# Altium schematic sheet Communication.SchDoc
size A; SheetNumber: 1; SheetTotal: 10
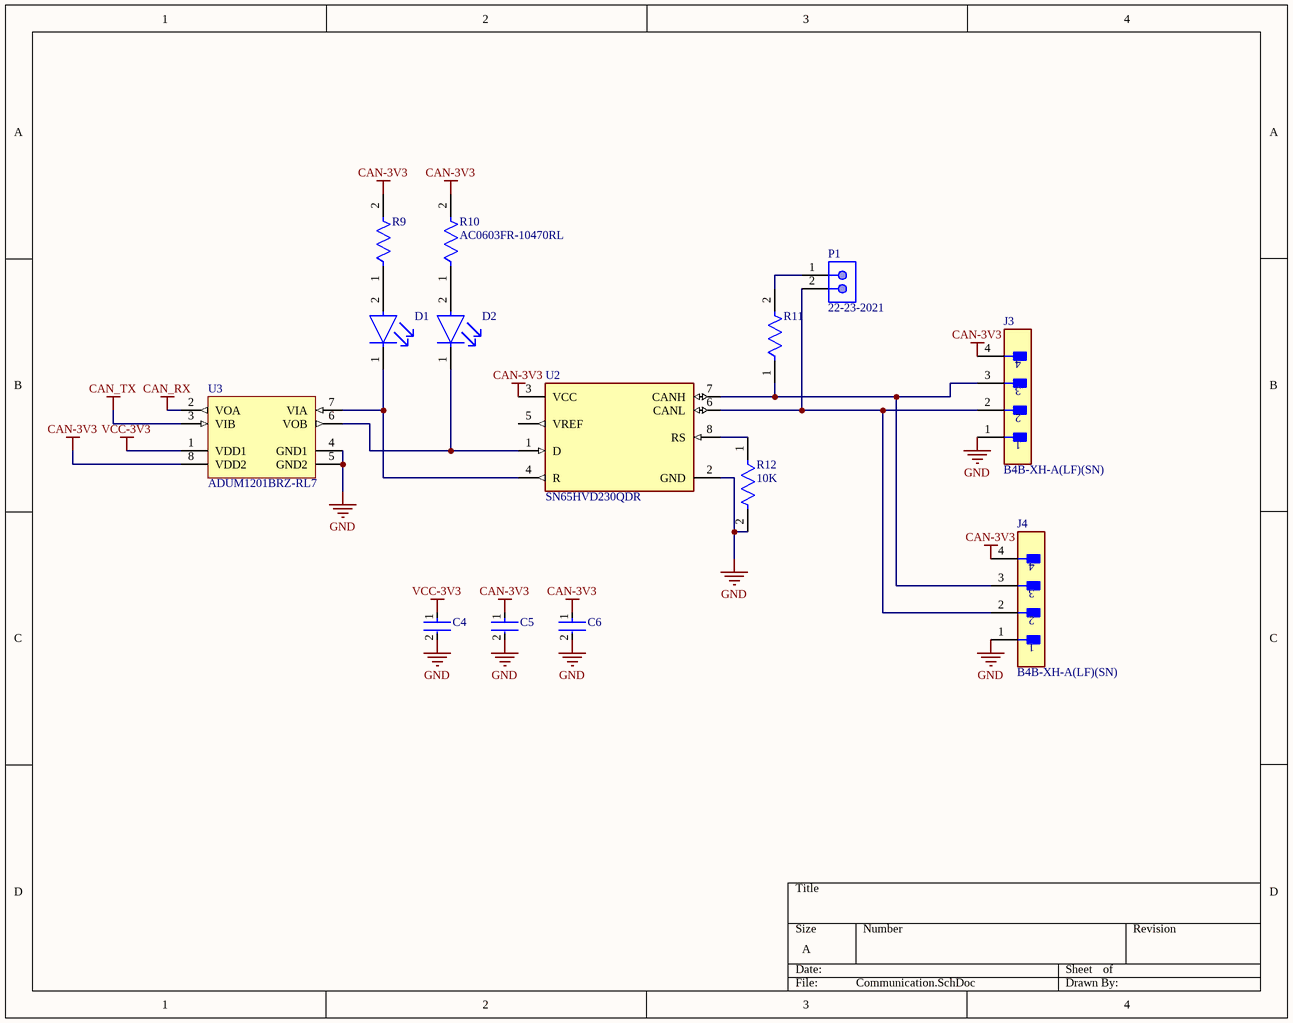
[diagram p0: Communication.SchDoc]

## Parts
C4  CC0603KRX7R9BB104  [FP-CC0603-DA-MFG]  (value not drawn)
C5  CC0603KRX7R9BB104  [FP-CC0603-DA-MFG]  (value not drawn)
C6  CC0603KRX7R9BB104  [FP-CC0603-DA-MFG]  (value not drawn)
D1  APHCM2012CGCK-F01  [FP-APHCM2012CGCK-F01-MFG]  (value not drawn)
D2  APHCM2012CGCK-F01  [FP-APHCM2012CGCK-F01-MFG]  (value not drawn)
J3  B4B-XH-A(LF)(SN)  [FP-B4B-XH-A_LF_SN-MFG]
J4  B4B-XH-A(LF)(SN)  [FP-B4B-XH-A_LF_SN-MFG]
P1  22-23-2021  [MOLX-22-23-2021_V]
R9  AC0603FR-10470RL  [FP-AC0603-IPC_A]  (value not drawn)
R10  AC0603FR-10470RL  [FP-AC0603-IPC_A]
R11  RT0603FRE07120RL  [FP-RT0603-MFG]  (value not drawn)
R12  10K  [FP-RC0603-0_55-IPC_C]
U2  SN65HVD230QDR  [FP-D0008A-IPC_C]
U3  ADUM1201BRZ-RL7  [ADI-R-8_L]

## Nets
CAN-3V3: C5.1 C6.1 J3.4 J4.4 R9.2 R10.2 U2.3(VCC) U3.8(VDD2)
CAN_RX: U3.2(VOA)
CAN_TX: U3.3(VIB)
GND: C4.2 C5.2 C6.2 J3.1 J4.1 R12.2 U2.2(GND) U3.4(GND1) U3.5(GND2)
VCC-3V3: C4.1 U3.1(VDD1)
NetD1_1: D1.1(C) U2.4(R) U3.7(VIA)
NetD1_2: D1.2(A) R9.1
NetD2_1: D2.1(C) U2.1(D) U3.6(VOB)
NetD2_2: D2.2(A) R10.1
NetJ3_2: J3.2 J4.2 P1.2 U2.6(CANL)
NetJ3_3: J3.3 J4.3 R11.1 U2.7(CANH)
NetP1_1: P1.1 R11.2
NetR12_1: R12.1 U2.8(RS)

Not connected (* = marked no-connect by the designer): U2 5(VREF)

## Library data of the parts
C4-C6 = CMP-2100-03601-2: CAP CER 0.1UF 50V X7R 0603; Manufacturer: YAGEO; Material: Ceramic; Capacitance: 100 nF; Temperature Coefficient: 15%; Tolerance: 0.1; Value: 100 nF; Height: 0.9mm; Voltage: 50 V; ComponentLink2Description: Datasheet; Device Class L2: Capacitors; Temperature Range High: +125°C; Category: Cap; Footprint Url: http://www.yageo.com/exep/pages/download/literatures/UPY-C_GEN_24.pdf; ComponentLink2URL: http://www.yageo.com/documents/recent/UPY-GPHC_X7R_6.3V-to-50V_18.pdf; Package: CC0603-DA; Temperature: -55°C to +125°C; Voltage Rating: 50 V; Temperature Characteristic: X7R; Device Class L1: Passive Components; Temperature Range Low: -55°C; Manufacturer Part Number: CC0603KRX7R9BB104; RoHS: TRUE; Automotive: No; Device Class L3: Ceramic Capacitors; Octopart: https://octopart.com/cc0603krx7r9bb104-yageo-42244635; Mouser Description: Multilayer Ceramic Capacitor, CC Series, 0.1 - F, - 10%, X7R, 50 V, 0603 [1608 Metric]; Lead Free: Yes; Digikey Description: CAP CER 0.1UF 50V X7R 0603
D1 D2 = CMP-44529-000062-1: LED GREEN CLEAR CHIP SMD; Dominant Wavelength: 570nm; Forward Current: 20mA; Number of LEDs: 1; Luminous Intensity: 40mcd; Forward Voltage: 2.1V; Viewing Angle: 110°; Illumination Color: Green; Lens Style: Clear; Mount: Surface Mount; Length: 2mm; Max Operating Temperature: 85°C; Series: APHCM; Width: 1.25mm; Lead Free: Lead Free; Wavelength: 570nm; Package Quantity: 1; Number of Pins: 2; Case Code (Metric): 2012; RoHS Compliant: Yes; Packaging: Tape and Reel; Lens Color: Clear; Case/Package: 0805; Case Code (Imperial): 0805; Test Current: 20mA; Color: Green; Min Operating Temperature: -40°C; Height: 0.4mm
J3 J4 = CMP-17439-000250-1: CONN HEADER VERT 4POS 2.5MM; Number of Contacts: 4; Contact Resistance: 20mR; Voltage Rating: 250V; Max Current Rating: 3A; Gender: Male; Wire/Cable Gauge: 22AWG; Mated Stacking Heights: 9.8mm; Insulation Resistance: 1GR; Orientation: Straight; Contact Type: Male Pin; Contact Finish - Mating: TIN; Series: XH; Max Voltage Rating (AC): 250V; Lead Pitch: 2.5mm; Contact Shape: Square; Insulation Color: Natural; Termination: Solder; Lead Free: Lead Free; Voltage Rating (AC): 250V; Number of Rows: 1; Flammability Rating: UL94 V-0; Number of Positions: 4; Max Operating Temperature: 85°C; Package Quantity: 500; Mount: Through Hole; REACH SVHC: No SVHC; Connector Type: Header; Insulation Material: Nylon; Fastening Type: Detent; Min Operating Temperature: -25°C; Housing Color: White; Packaging: Bulk; Contact Plating: Tin; Contact Material: Brass; Max Voltage Rating (DC): 250V; Housing Material: Polyamide; Color: Natural; Material: Polyamide; Pitch: 2.5mm; Depth: 5.75mm; Current Rating: 3A; Length: 12.4mm
P1 = CMP-1704-00001-3: Male Header, Pitch 2.54 mm, 1 x 2 Position, Height 10.67 mm, Tail Length 3.56 mm, 0 to 75 degC, RoHS, Bulk; Package Quantity: 3000; Height: 10.67 mm; RoHSCompliant: True; ComponentLink2URL: https://datasheet.ciiva.com/19454/232266-19454304.pdf; PartNumber: 22-23-2021; Packaging: Bulk; ComponentLink2Description: Datasheet; Min Operating Temperature: 0 degC; ComponentLink1Description: Manufacturer URL; Length: 5.08 mm; Mounting Technology: Through Hole; Max Operating Temperature: 75 degC; REACH SVHC: Unknown; PackageDescription: Male Header, Pitch 2.54 mm, 1 x 2 Position, Height 10.67 mm, Tail Length 3.56 mm; ComponentLink1URL: http://www.molex.com/; Mount: Through Hole; Radiation Hardening: No; Width: 6.35 mm; Pins: 2
R9 R10 = CMP-03412-002877-2: RES 470Ω 1.00% 0.1W 0603; Tolerance: 1%; Resistance: 470R; Case/Package: 0603; RoHS Compliant: Yes
R11 = CMP-03412-010455-1: RES SMD 120 OHM 1% 1/10W 0603; Manufacturer: Yageo; Voltage Rating: 75V; Resistance: 120Ω; Value: 120Ω; Temperature Coefficient: 50 ppm/°C; Power Rating: 0.1W; Tolerance: 0.01; Ipc Land Pattern Name: RESC16080X45; Category: Res; Mouser Description: High Precision-High Stability Chip Resistor Thin Film 0603 120Ohm 1% Paper T/R; Series: RT; Device Class L1: Passive Components; Height: 0.55mm; Composition: Thin Film; Temperature Range High: +155°C; Octopart: https://octopart.com/rt0603fre07120rl-yageo-40001924; RoHS: TRUE; Footprint Url: http://www.yageo.com/exep/pages/download/literatures/PYu-R_Mount_10.pdf; Manufacturer Part Number: RT0603FRE07120RL; Device Class L3: Chip SMD Resistors; Lead Free: Yes; Digikey Description: RES SMD 120 OHM 1% 1/10W 0603; ComponentLink2Description: Datasheet; Temperature: -55°C to +155°C; Package: RT0603; Device Class L2: Resistors; ComponentLink2URL: http://www.yageo.com/documents/recent/PYu-RT_1-to-0.01_RoHS_L_9.pdf; Temperature Range Low: -55°C; Automotive: No; JLCPCB: 0603WAF1200T5E
R12 = CMP-2100-03664-2: RES 10K OHM 1% 1/10W 0603; Voltage Rating: 75V; Voltage Rating (DC): 50V; Resistance: 10kR; Power Rating: 100mW; Temperature Coefficient: 100ppm/°C; Depth: 0.8mm; Termination: SMD/SMT; Resistor Type: Thick Film; Series: RC; Construction: Rectangular; Features: Moisture Resistant; Packaging: Tape and Reel; Min Operating Temperature: -55°C; Number of Terminations: 2; Lead Pitch: 0.3mm; RoHS Compliant: Yes; Case/Package: 0603; Resistance Tolerance: 1%; Military Standard: Not; Weight: 7.1E-05oz; Number of Pins: 2; Tolerance: 1%; Length: 1.6mm; Case Code (Imperial): 0603; Lead Free: Lead Free; Width: 0.8mm; Max Power Dissipation: 100mW; Height: 0.45mm; Max Operating Temperature: 155°C; Case Code (Metric): 1608; Size Code: 0603
U2 = CMP-0315-00033-3: IC TRANSCEIVER HALF 1/1 8SOIC; Max Supply Current: 17mA; Number of Receivers: 1; Data Rate: 1Mbps; Simplex/Duplex: Half Duplex; Receiver Hysteresis: 100mV; Min Supply Voltage: 3V; Max Supply Voltage: 3.6V; Operating Supply Voltage: 3.3V; Number of Pins: 8; RoHS Compliant: Yes; Case/Package: D; Number of Drivers: 1; Packaging: Tape and Reel; Weight: 0.002822oz; Max Operating Temperature: 125°C; Package Quantity: 2500; Min Operating Temperature: -40°C; Nominal Supply Current: 17mA; Radiation Hardening: No; Number of Transceivers: 1; Contact Plating: Gold; Lead Free: Lead Free
U3 = CMP-0534-00027-1: Dual Channel Digital Isolator, 2.5 KV rms Insulation Rating, 10 Mbps Data Rate, 50 ns Delay, Industrial, 8-pin SOIC (R-8), Reel; Manufacturer: Analog Devices; Insulation Rating (kVrms): 2.5; Max Data Rate: 10Mbps; Code_JEDEC: MS-012-AA; ComponentLink3URL: http://www.analog.com/static/imported-files/packages/PKG_PDF/SOIC_Narrow%20(R)/R_8.pdf; PackageDescription: 8-Pin Standard Small Outline Package, Body 4.9 x 3.9 mm, Pitch 1.27 mm; ComponentLink2URL: http://www.analog.com/static/imported-files/data_sheets/ADuM1200_1201.pdf; DatasheetVersion: Rev. I; ComponentLink1URL: http://www.analog.com/en/index.html; PartNumber: ADUM1201BRZ-RL7; Mounting Technology: Surface Mount; ComponentLink3Description: Package Specification; ComponentLink1Description: Manufacturer URL; PackageVersion: 060506-A, 06/2006; ComponentLink2Description: Datasheet; Max Operating Temp (degreesC): 125; PackageReference: R-8; ComponentLink4URL: Product URL:http://www.analog.com/en/interface-isolation/digital-isolators/adum1201/products/product.html; ComponentLink4Description: URL Link1; ComponentLink5URL: Reference Circuit:http://www.analog.com/en/interface-isolation/digital-isolators/adum1201/products/product.html#product-recommendations; ComponentLink5Description: URL Link2